# Altium project Power_Breakout.PrjPcb
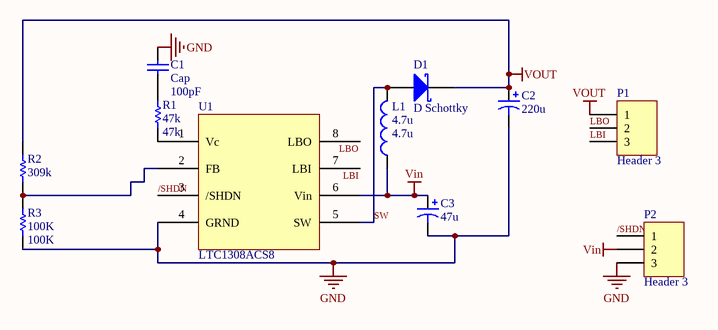
[diagram p0: Power_Breakout.SchDoc]
1 sheet, 11 parts. Net scope: global (net labels, ports and power ports of the same name join across sheets).
Board file: Power Breakout.PcbDoc

## Sheet Power_Breakout.SchDoc
size Letter

### Parts
C1  Cap  value 100pF  [C0805]
C2  220u  [C2917]
C3  47u  [C2312]
D1  D Schottky  [ShottkeyDiode]
L1  4.7u  [Inductor]
P1  Header 3  [HDR1X3]
P2  Header 3  [HDR1X3]
R1  47k  [6-0805_M]
R2  309k  [6-0805_M]
R3  100K  [6-0805_M]
U1  LTC1308ACS8  [SOP8_LTC1308A]

### Nets
GND: C1.1 C2.2 C3.2 P2.3 R3.2 U1.4(GRND)
Vin: C3.1 L1.1 P2.2 U1.6(Vin)
VOUT: C2.1 D1.K P1.1 R2.1
/SHDN: P2.1 U1.3(/SHDN)
LBI: P1.3 U1.7(LBI)
LBO: P1.2 U1.8(LBO)
SW: D1.A L1.2 U1.5(SW)
NetC1_2: C1.2 R1.2
NetR1_1: R1.1 U1.1(Vc)
NetR2_2: R2.2 R3.1 U1.2(FB)

### Library data of the parts
C1 = Cap: Capacitor; Published: 8-Jun-2000; LatestRevisionDate: 17-Jul-2002; LatestRevisionNote: Re-released for DXP Platform.; PackageReference: RAD-0.3; Publisher: Altium Limited; PackageDescription: Radial Cap, Thru-Hole; 2 Leads; 0.3 in Pin Spacing
C2 C3 = Cap Pol1: Polarized Capacitor (Radial); Published: 8-Jun-2000; LatestRevisionDate: 17-Jul-2002; LatestRevisionNote: Re-released for DXP Platform.; PackageReference: RB7.6-15; Publisher: Altium Limited; PackageDescription: Polarized Capacitor (Radial); 2 Leads
  C2: Value: 220u
  C3: Value: 47u
D1 = D Schottky: Schottky Diode; Published: 8-Jun-2000; LatestRevisionDate: 17-Jul-2002; LatestRevisionNote: Re-released for DXP Platform.; PackageReference: SMB; Publisher: Altium Limited; PackageDescription: DO-214-AA/SMB; 2 C-Bend Leads; Body 5.3 x 3.6 mm, inc. leads (LxW); Code_JEDEC: DO-214-AA
L1 = Inductor: Code_IEC: 1005; Published: 8-Jun-2000; LatestRevisionDate: 29-May-2009; LatestRevisionNote: IPC-7351 Footprint Added.; PackageReference: 0402-A; Publisher: Altium Limited; PackageDescription: Chip Inductor; Code_JEITA: 0402; Value: 4.7u
P1 P2 = Header 3: Header, 3-Pin; LatestRevisionDate: 17-Jul-2002; LatestRevisionNote: Re-released for DXP Platform.; Publisher: Altium Limited
R1-R3 = Res1: Resistor; Published: 8-Jun-2000; LatestRevisionDate: 17-Jul-2002; LatestRevisionNote: Re-released for DXP Platform.; PackageReference: AXIAL-0.3; Publisher: Altium Limited; PackageDescription: Axial Device, Thru-Hole; 2 Leads; 0.3 in Pin Spacing
  R1: Value: 47k
  R2: Value: 309k
  R3: Value: 100K